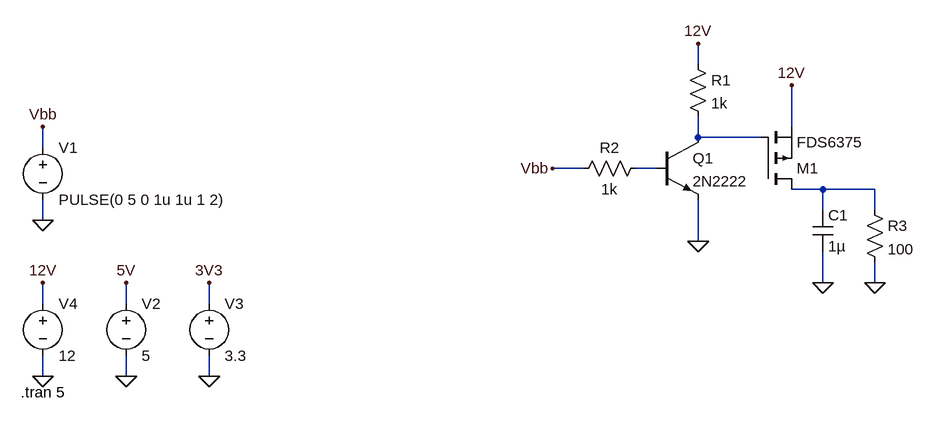
[diagram p0: schematic LV_PMOS_HSS.asc]
LV_PMOS_HSS.asc, the LTspice schematic file:
Version 4
SHEET 1 1300 680
WIRE 960 -32 960 -64
WIRE 1104 64 1104 0
WIRE 960 80 960 48
WIRE 1056 80 960 80
WIRE -48 96 -48 64
WIRE 784 128 736 128
WIRE 896 128 864 128
WIRE 1152 160 1104 160
WIRE 1232 160 1152 160
WIRE 1152 192 1152 160
WIRE 1232 192 1232 160
WIRE -48 208 -48 176
WIRE 960 240 960 176
WIRE 1152 304 1152 256
WIRE 1232 304 1232 272
WIRE -48 336 -48 304
WIRE 80 336 80 304
WIRE 208 336 208 304
WIRE -48 448 -48 416
WIRE 80 448 80 416
WIRE 208 448 208 416
FLAG -48 208 0
FLAG -48 64 Vbb
FLAG 80 448 0
FLAG 80 304 5V
FLAG 208 448 0
FLAG 208 304 3V3
FLAG -48 448 0
FLAG -48 304 12V
FLAG 960 240 0
FLAG 1104 0 12V
FLAG 1232 304 0
FLAG 1152 304 0
FLAG 736 128 Vbb
FLAG 960 -64 12V
SYMBOL voltage -48 80 R0
WINDOW 123 0 0 Left 0
WINDOW 39 0 0 Left 0
SYMATTR InstName V1
SYMATTR Value PULSE(0 5 0 1u 1u 1 2)
SYMBOL voltage 80 320 R0
WINDOW 123 0 0 Left 0
WINDOW 39 0 0 Left 0
SYMATTR InstName V2
SYMATTR Value 5
SYMBOL voltage 208 320 R0
WINDOW 123 0 0 Left 0
WINDOW 39 0 0 Left 0
SYMATTR InstName V3
SYMATTR Value 3.3
SYMBOL voltage -48 320 R0
WINDOW 123 0 0 Left 0
WINDOW 39 0 0 Left 0
SYMATTR InstName V4
SYMATTR Value 12
SYMBOL npn 896 80 R0
SYMATTR InstName Q1
SYMATTR Value 2N2222
SYMBOL res 944 -48 R0
SYMATTR InstName R1
SYMATTR Value 1k
SYMBOL res 880 112 R90
WINDOW 0 0 56 VBottom 2
WINDOW 3 32 56 VTop 2
SYMATTR InstName R2
SYMATTR Value 1k
SYMBOL res 1216 176 R0
SYMATTR InstName R3
SYMATTR Value 100
SYMBOL cap 1136 192 R0
SYMATTR InstName C1
SYMATTR Value 1µ
SYMBOL pmos 1056 160 M180
SYMATTR InstName M1
SYMATTR Value FDS6375
TEXT -82 472 Left 2 !.tran 5

The netlist it stands for:
* LV_PMOS_HSS.asc
V1 Vbb 0 PULSE(0 5 0 1u 1u 1 2)
V2 5V 0 5
V3 3V3 0 3.3
V4 12V 0 12
Q1 N001 N002 0 0 2N2222
R1 12V N001 1k
R2 N002 Vbb 1k
R3 N003 0 100
C1 N003 0 1µ
M1 N003 N001 12V 12V FDS6375
.model NPN NPN
.model PNP PNP
.lib standard.bjt
.model NMOS NMOS
.model PMOS PMOS
.lib standard.mos
.tran 5
.backanno
.end